# Altium project NANORACK_EXT_LASER.PrjPcb
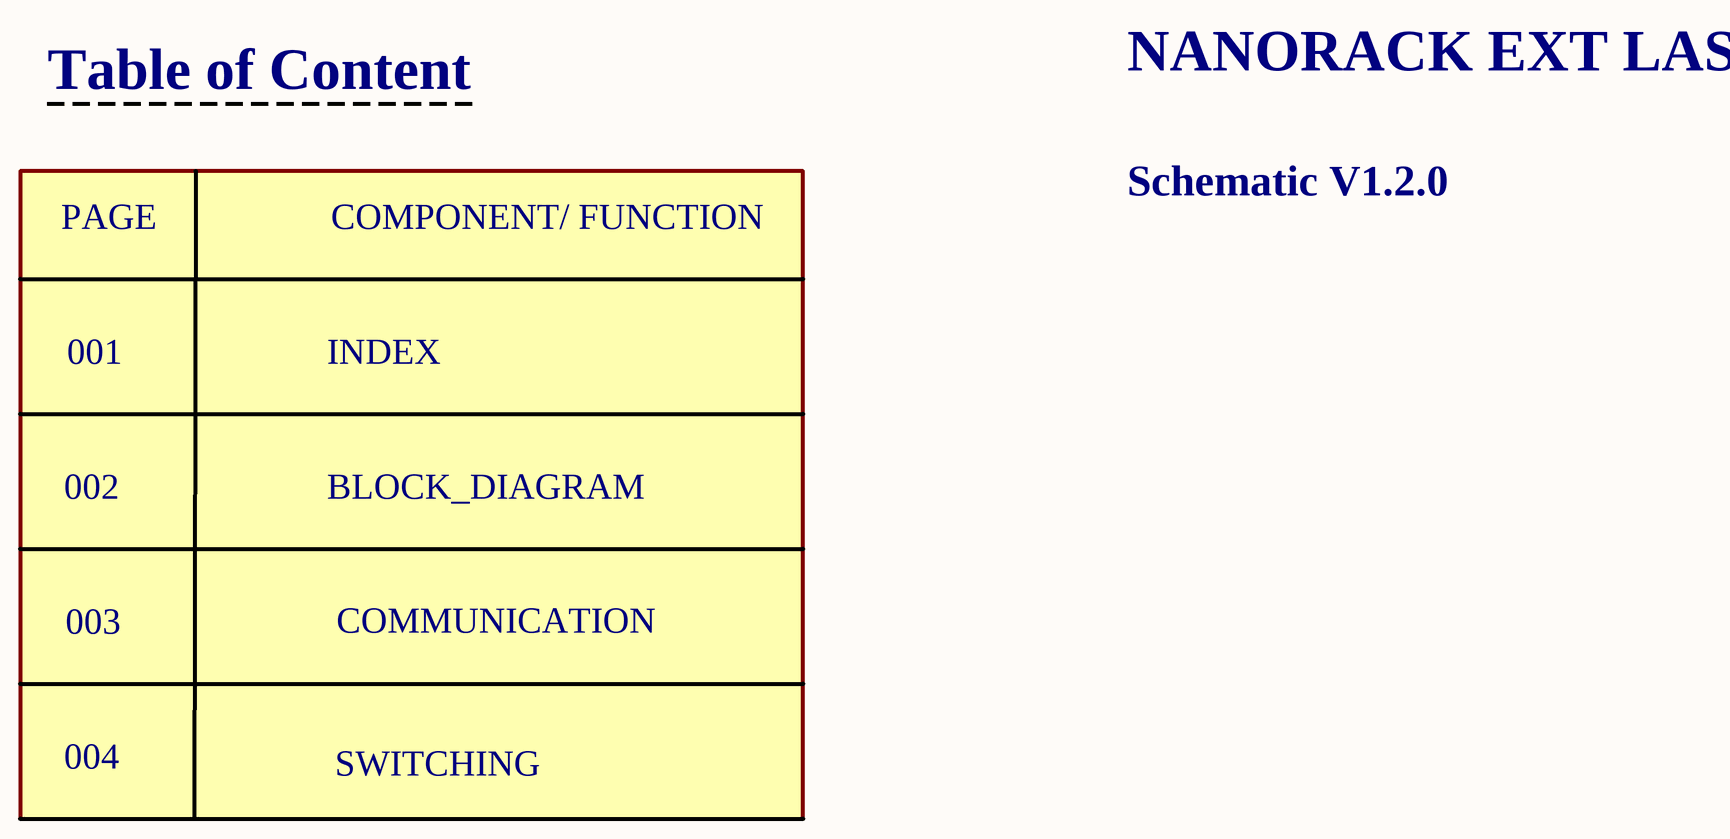
[diagram p0: INDEX.SchDoc]
4 sheets, 33 parts. Net scope: global (net labels, ports and power ports of the same name join across sheets).
Board file: EXT_LASERDIODE_V1.2.0.PcbDoc
Sheets:
  INDEX.SchDoc
  BLOCK_DIAGRAM.SchDoc
  COMMUNICATION.SchDoc
  SWITCHING.SchDoc

## Sheet INDEX.SchDoc
size 420 x 297 mm; SheetNumber: 1; SheetTotal: 4

### Notes on the sheet
- Table of Content
- NANORACK EXT LASER
- PAGE
- COMPONENT/ FUNCTION
- Schematic V1.2.0
- 001
- INDEX
- 002
- BLOCK_DIAGRAM
- 003
- COMMUNICATION
- 004
- SWITCHING
- Project:
- BEE-PC1
- Sub-system:
- Design by:
- Hung Nguyen D.
- Bao Bui Q.
- Sheet title:
- Sheet
- A3
- of
- Checked by:
- Approved by:
- Vu Pham
- Revision:
- Document No:
- V1.2.0
- Size:
- Date:

## Sheet BLOCK_DIAGRAM.SchDoc
size 420 x 297 mm; SheetNumber: 2; SheetTotal: 4

### Notes on the sheet
- Project:
- BEE-PC1
- Sub-system:
- Design by:
- Hung Nguyen D.
- Bao Bui Q.
- Sheet title:
- Sheet
- A3
- of
- Checked by:
- Approved by:
- Vu Pham
- Revision:
- Document No:
- V1.2.0
- Size:
- Date:
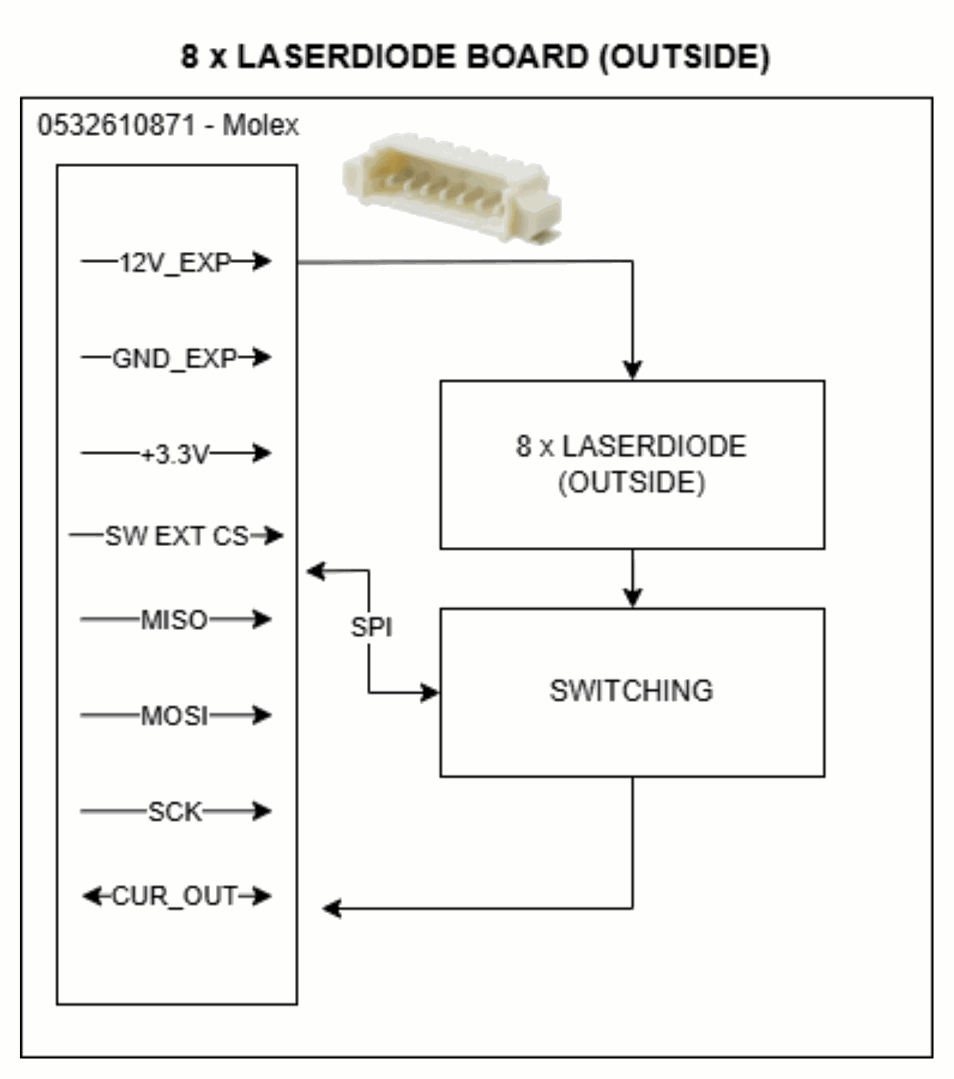
[diagram p1: BLOCK_DIAGRAM.SchDoc]

## Sheet COMMUNICATION.SchDoc
size 420 x 297 mm; SheetNumber: 3; SheetTotal: 4
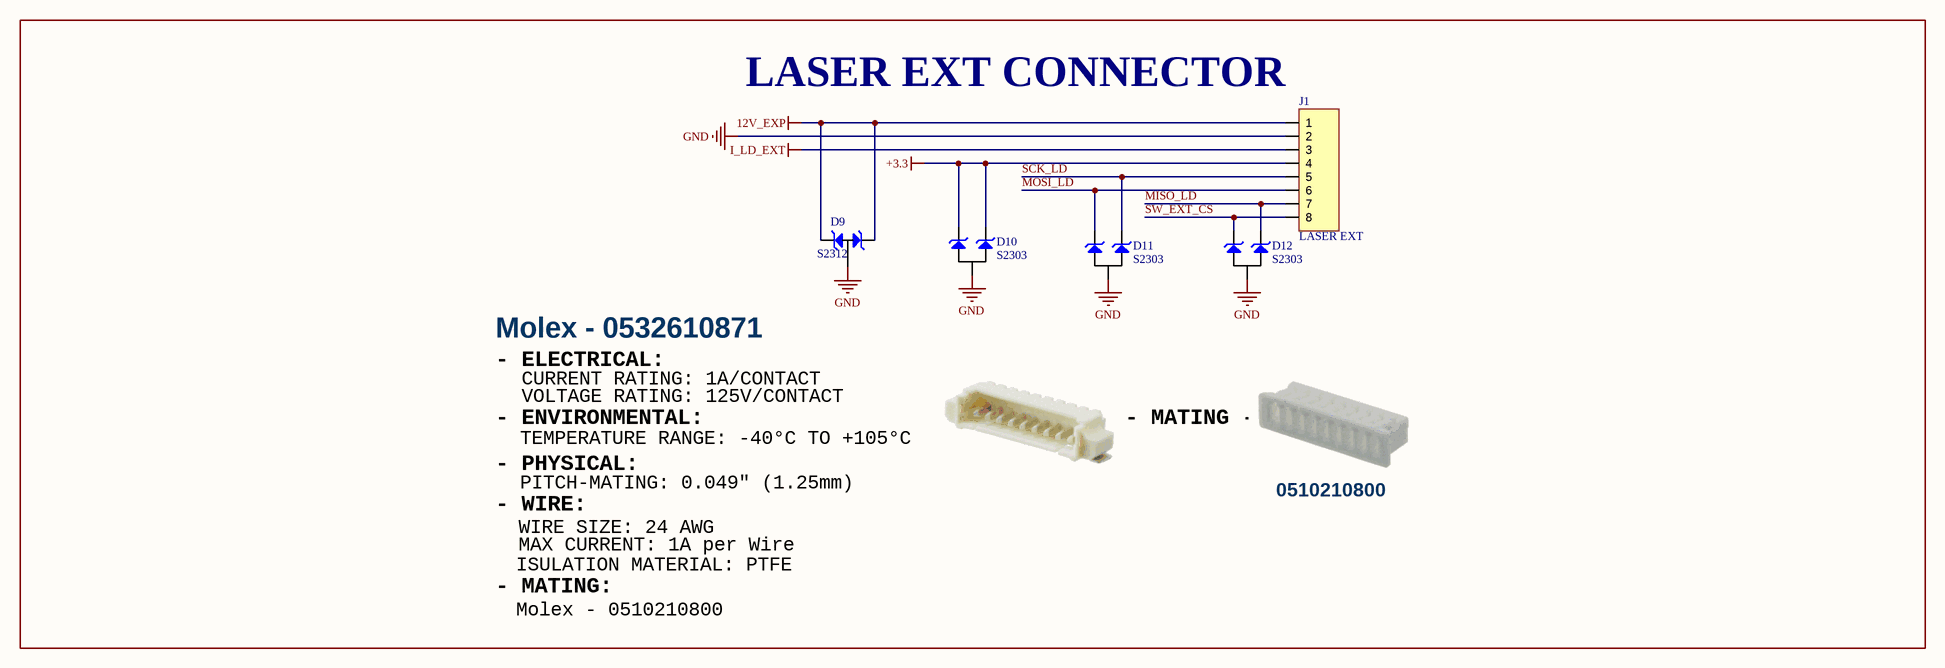
[diagram p2: COMMUNICATION.SchDoc]

### Parts
D9  S2312  [SOT23-123]
D10  S2303  [SOT23-123]
D11  S2303  [SOT23-123]
D12  S2303  [SOT23-123]
J1  LASER EXT  [0532610871]

### Nets
12V_EXP: D9.1 D9.3 J1.1
+3.3: D10.1 D10.3 J1.4
GND: D9.2 D10.2 D11.2 D12.2 J1.2
I_LD_EXT: J1.3
MISO_LD: D12.3 J1.7
MOSI_LD: D11.1 J1.6
SCK_LD: D11.3 J1.5
SW_EXT_CS: D12.1 J1.8

### Notes on the sheet
- LASER EXT CONNECTOR
- Molex - 0532610871
- - ELECTRICAL:
- CURRENT RATING: 1A/CONTACT
- VOLTAGE RATING: 125V/CONTACT
- - ENVIRONMENTAL:
- - PHYSICAL:
- TEMPERATURE RANGE: -40°C TO +105°C
- - MATING -
- - WIRE:
- WIRE SIZE: 24 AWG
- PITCH-MATING: 0.049" (1.25mm)
- 0510210800
- - MATING:
- ISULATION MATERIAL: PTFE
- MAX CURRENT: 1A per Wire
- Molex - 0510210800
- Project:
- BEE-PC1
- Sub-system:
- Design by:
- Hung Nguyen D.
- Bao Bui Q.
- Sheet title:
- Sheet
- A3
- of
- Checked by:
- Approved by:
- Vu Pham
- Revision:
- Document No:
- V1.2.0
- Size:
- Date:

### Library data of the parts
D9 = S2315: TVS DIODE 12VWM 19VC SOT23, P/N:  S2312
D10-D12 = S2303: TVS DIODE 3.3VWM 8VC SOT23, P/N: / S2303
J1 = JP8: WR-PHD 2.54 mm Angled Socket Header; Manufacturer: W¨¹rth Elektronik eiSos GmbH; partNo: 613008143121; ComponentLink1 Description: Manufacturer; ComponentLink2 Description: Datasheet; NoPins: 08; Created Date: 29 March 2013; ComponentLink1URL: http://www.we-online.com; ComponentLink2URL: http://katalog.we-online.de/em/datasheet/6130xx143121.pdf; Created by: Karrer Zheng

## Sheet SWITCHING.SchDoc
size 420 x 297 mm; SheetNumber: 4; SheetTotal: 4
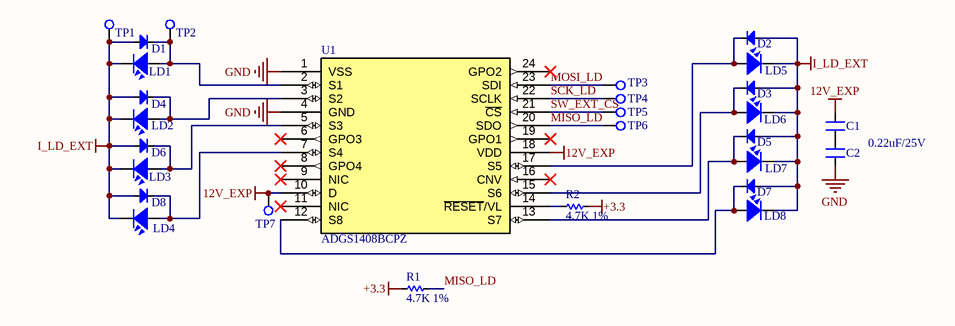
[diagram p3: SWITCHING.SchDoc]

### Parts
C1  0.22uF/25V  [SM-0603]  (value not drawn)
C2  0.22uF/25V  [SM-0603]
D1  1N4148W-TP  [SOD23]  (value not drawn)
D2  1N4148W-TP  [SOD23]  (value not drawn)
D3  1N4148W-TP  [SOD23]  (value not drawn)
D4  1N4148W-TP  [SOD23]  (value not drawn)
D5  1N4148W-TP  [SOD23]  (value not drawn)
D6  1N4148W-TP  [SOD23]  (value not drawn)
D7  1N4148W-TP  [SOD23]  (value not drawn)
D8  1N4148W-TP  [SOD23]  (value not drawn)
LD1  LaserDiode  [LASER]  (value not drawn)
LD2  LaserDiode  [LASER]  (value not drawn)
LD3  LaserDiode  [LASER]  (value not drawn)
LD4  LaserDiode  [LASER]  (value not drawn)
LD5  LaserDiode  [LASER]  (value not drawn)
LD6  LaserDiode  [LASER]  (value not drawn)
LD7  LaserDiode  [LASER]  (value not drawn)
LD8  LaserDiode  [LASER]  (value not drawn)
R1  4.7K 1%  [RES-SMD-0603]
R2  4.7K 1%  [RES-SMD-0603]
TP1  Test_Point  [TESTPOINT]  (value not drawn)
TP2  Test_Point  [TESTPOINT]  (value not drawn)
TP3  Test_Point  [TESTPOINT]  (value not drawn)
TP4  Test_Point  [TESTPOINT]  (value not drawn)
TP5  Test_Point  [TESTPOINT]  (value not drawn)
TP6  Test_Point  [TESTPOINT]  (value not drawn)
TP7  Test_Point  [TESTPOINT]  (value not drawn)
U1  ADGS1408BCPZ  [ADGS1408BCPZ]

### Nets
12V_EXP: C1.2 TP7.1 U1.10(D) U1.18(VDD)
+3.3: R1.2 R2.1
GND: C2.1 U1.1(VSS) U1.4(GND)
I_LD_EXT: D1.1(A) D2.1(A) D3.1(A) D4.1(A) D5.1(A) D6.1(A) D7.1(A) D8.1(A) LD1.3 LD2.3 LD3.3 LD4.3 LD5.3 LD6.3 LD7.3 LD8.3 TP1.1
MISO_LD: R1.1 TP6.1 U1.20(SDO)
MOSI_LD: TP3.1 U1.23(SDI)
SCK_LD: TP4.1 U1.22(SCLK)
SW_EXT_CS: TP5.1 U1.21(~{CS})
NetC1_1: C1.1 C2.2
NetD1_2: D1.2(K) LD1.1 TP2.1 U1.2(S1)
NetD2_2: D2.2(K) LD5.1 U1.17(S5)
NetD3_2: D3.2(K) LD6.1 U1.15(S6)
NetD4_2: D4.2(K) LD2.1 U1.3(S2)
NetD5_2: D5.2(K) LD7.1 U1.13(S7)
NetD6_2: D6.2(K) LD3.1 U1.5(S3)
NetD7_2: D7.2(K) LD8.1 U1.12(S8)
NetD8_2: D8.2(K) LD4.1 U1.7(S4)
NetR2_2: R2.2 U1.14(~{RESET}/VL)

Not connected (* = marked no-connect by the designer): U1 6(GPO3)* 8(GPO4)* 9(NIC)* 11(NIC)* 16(CNV)* 19(GPO1)* 24(GPO2)*

### Notes on the sheet
- Project:
- BEE-PC1
- Sub-system:
- Design by:
- Hung Nguyen D.
- Bao Bui Q.
- Sheet title:
- Sheet
- A3
- of
- Checked by:
- Approved by:
- Vu Pham
- Revision:
- Document No:
- V1.2.0
- Size:
- Date:

### Library data of the parts
C1 C2 = CM: 0603; Value: 103
D1-D8 = Diode SMD: DIODE GEN PURP 100V 150MA SOD123; Code - JEDEC: DO-214-AB; Value: 1N5007; Published: 8-Jun-2000; Revision: July-2002: Re-released for DXP Platform.; Publisher: Altium Limited
LD1-LD8 = LD
R1 R2 = Res-SMD: 0603; Manufacturer: Generic Components; Class: Passive; Published: 08/06/2000; Publisher: Altium Hobart Technology Centre
U1 = ADGS1408: IC MUX 8:1 4.7OHM 24LFCSP

## Nets that join several sheets
12V_EXP: COMMUNICATION (D9.1 D9.3 J1.1), SWITCHING (C1.2 TP7.1 U1.10 U1.18)
+3.3: COMMUNICATION (D10.1 D10.3 J1.4), SWITCHING (R1.2 R2.1)
GND: COMMUNICATION (5 pins), SWITCHING (C2.1 U1.1 U1.4)
I_LD_EXT: COMMUNICATION (J1.3), SWITCHING (17 pins)
MISO_LD: COMMUNICATION (D12.3 J1.7), SWITCHING (R1.1 TP6.1 U1.20)
MOSI_LD: COMMUNICATION (D11.1 J1.6), SWITCHING (TP3.1 U1.23)
SCK_LD: COMMUNICATION (D11.3 J1.5), SWITCHING (TP4.1 U1.22)
SW_EXT_CS: COMMUNICATION (D12.1 J1.8), SWITCHING (TP5.1 U1.21)